# Altium schematic sheet I2C.SchDoc: ITU AUV MAIN BOARD
size A3; DocumentNumber: 1; SheetNumber: 1
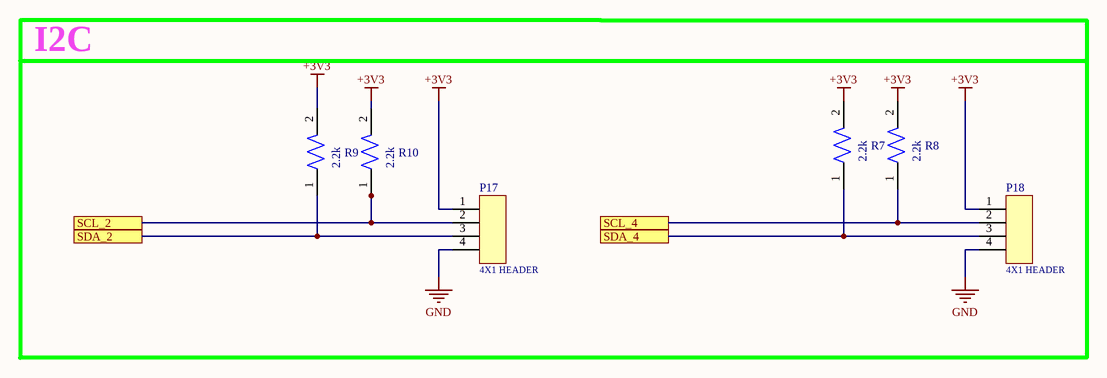
[diagram p0: I2C.SchDoc]

## Parts
P17  CONN HEADER SMD R/A 4POS 1.25MM  [DF13-4P-1.25V]  (value not drawn)
P18  CONN HEADER SMD R/A 4POS 1.25MM  [DF13-4P-1.25V]  (value not drawn)
R7  Dip resistor  [Resistor DIP]  (value not drawn)
R8  Dip resistor  [Resistor DIP]  (value not drawn)
R9  Dip resistor  [Resistor DIP]  (value not drawn)
R10  Dip resistor  [Resistor DIP]  (value not drawn)

## Blocks framed on the sheet
I2C: P17 P18 R7-R10

## Ports
SCL_2, SCL_4, SDA_2, SDA_4

## Nets
+3V3: P17.1 P18.1 R7.2 R8.2 R9.2 R10.2
GND: P17.4 P18.4
SCL_2: P17.2 R10.1 ; port SCL_2
SCL_4: P18.2 R8.1 ; port SCL_4
SDA_2: P17.3 R9.1 ; port SDA_2
SDA_4: P18.3 R7.1 ; port SDA_4

## Notes on the sheet
- (in symbol 2.2k dip) 2.2k
- (in symbol DF13-4P-1.25H(21)) 4X1 HEADER

## Library data of the parts
P17 P18 = DF13-4P-1.25H(21): Conn Shrouded Header HDR 4 POS 1.25mm Solder RA SMD Embossed T/R; Manufacturer: Hirose; Number of Contacts: 4; Current Rating: 1A; Connector Type: Male Pin; Voltage Rating (AC): 150V; Designed By: Süeda KORKMAZ; Supplier 1: Digi-Key; Manufacturer Part Number: DF13-4P-1.25H(21); RoHS: Yes; Category: Headers and Wire Housings; Stock 1: 39973; Pricing 1: 1=0,57000, 10=0,50100, 100=0,41300, 500=0,35910 (USD); Mount: Surface Mount; Color: Beige; Contact Plating: Tin; Contact Material: Brass; Housing Color: Beige; Housing Material: Polyamide; Number of Rows: 1; Termination: Solder; Package Quantity: 1000; Packaging: Tape and Reel; Number of Positions: 4; Length: 9.65mm; Height: 3.6mm; Pitch: 1.25mm; Radiation Hardening: No; Lead Free: Lead Free; ComponentLink1URL: https://datasheet.ciiva.com/5162/en-df13-20130411-268487-5162328.pdf?src-supplier=Mouser; ComponentLink1Description: https://datasheet.ciiva.com/5162/en-df13-20130411-268487-5162328.pdf?src-supplier=Mouser; Supplier Part Number 1: 26-DF13-4P-1.25H(21)CT-ND
R7-R10 = 2.2k dip: Manufacturer: Vishay; Manufacturer Part Number: CRCW06032K20FKEAHP; Resistance: 2.2kR; Tolerance: 1%; Temperature Coefficient: 100ppm/°C; Power Rating: 250mW; Voltage Rating: 75V; RoHS: Yes; Category: Chip SMD Resistors; Stock 1: 19777; Pricing 1: 1=0,17000, 10=0,14800, 100=0,05790, 1000=0,02422, 2500=0,02220 (USD); Mount: Surface Mount; Case/Package: 0603; Contact Plating: Tin; Case Code (Metric): 1608; Case Code (Imperial): 0603; Min Operating Temperature: -55°C; Max Operating Temperature: 155°C; Resistor Type: Thick Film; Packaging: Tape and Reel; Package Quantity: 1; Number of Terminations: 2; Termination: Solder; Max Power Dissipation: 250mW; Voltage Rating (DC): 75V; Features: Automotive AEC-Q200; Series: CRCW-HP; Construction: Rectangular; Technology: THICK FILM; Resistance Tolerance: 1%; Length: 1.6mm; Width: 0.033inch; Height: 0.02inch; Depth: 0.85mm; Radiation Hardening: No; REACH SVHC: Unknown; Military Standard: Not; Lead Free: Lead Free; RoHS Compliant: Yes